# Altium schematic sheet schematic_Func_Gen.SchDoc
size B; SheetNumber: 1; SheetTotal: 1
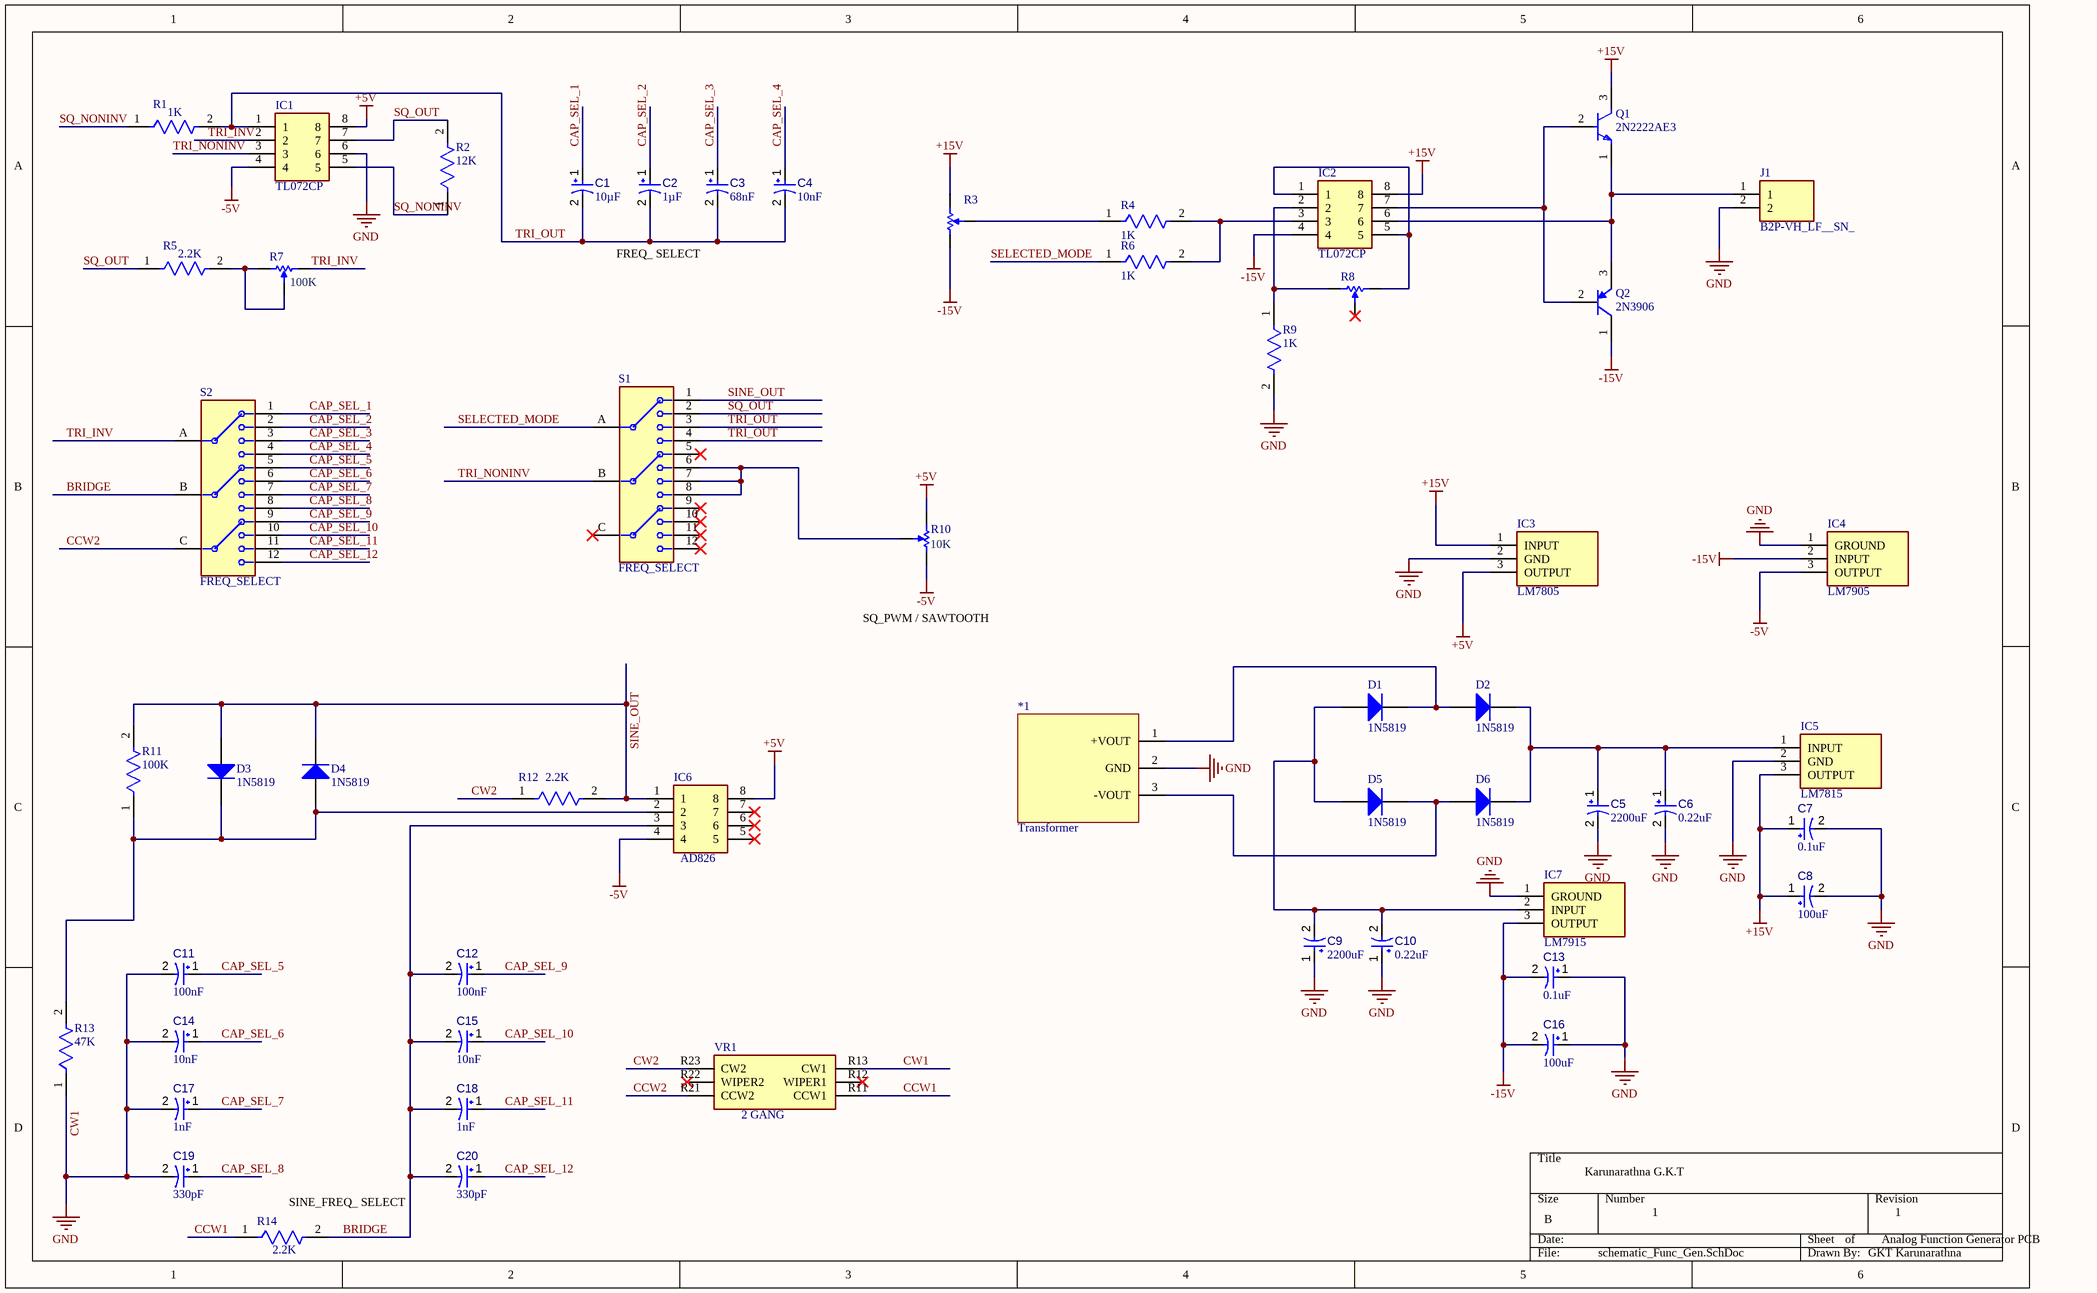
[diagram p0: schematic_Func_Gen.SchDoc]

## Parts
*1  Transformer  [transformer]
C1  value 10µF  [CAPPR65-500-1250X1000X1350]  (hidden comment: ECA-1HM221)
C2  value 1µF  [CAPPR65-500-1250X1000X1350]  (hidden comment: ECA-1HM221)
C3  value 68nF  [CAPPR65-500-1250X1000X1350]  (hidden comment: ECA-1HM221)
C4  value 10nF  [CAPPR65-500-1250X1000X1350]  (hidden comment: ECA-1HM221)
C5  value 2200uF  [CAPPR65-500-1250X1000X1350]  (hidden comment: ECA-1HM221)
C6  value 0.22uF  [CAPPR65-500-1250X1000X1350]  (hidden comment: ECA-1HM221)
C7  value 0.1uF  [CAPPR65-500-1250X1000X1350]  (hidden comment: ECA-1HM221)
C8  value 100uF  [CAPPR65-500-1250X1000X1350]  (hidden comment: ECA-1HM221)
C9  value 2200uF  [CAPPR65-500-1250X1000X1350]  (hidden comment: ECA-1HM221)
C10  value 0.22uF  [CAPPR65-500-1250X1000X1350]  (hidden comment: ECA-1HM221)
C11  value 100nF  [CAPPR65-500-1250X1000X1350]  (hidden comment: ECA-1HM221)
C12  value 100nF  [CAPPR65-500-1250X1000X1350]  (hidden comment: ECA-1HM221)
C13  value 0.1uF  [CAPPR65-500-1250X1000X1350]  (hidden comment: ECA-1HM221)
C14  value 10nF  [CAPPR65-500-1250X1000X1350]  (hidden comment: ECA-1HM221)
C15  value 10nF  [CAPPR65-500-1250X1000X1350]  (hidden comment: ECA-1HM221)
C16  value 100uF  [CAPPR65-500-1250X1000X1350]  (hidden comment: ECA-1HM221)
C17  value 1nF  [CAPPR65-500-1250X1000X1350]  (hidden comment: ECA-1HM221)
C18  value 1nF  [CAPPR65-500-1250X1000X1350]  (hidden comment: ECA-1HM221)
C19  value 330pF  [CAPPR65-500-1250X1000X1350]  (hidden comment: ECA-1HM221)
C20  value 330pF  [CAPPR65-500-1250X1000X1350]  (hidden comment: ECA-1HM221)
D1  1N5819  [ONSC-AXIAL_LEAD-2-59-10_P]
D2  1N5819  [ONSC-AXIAL_LEAD-2-59-10_P]
D3  1N5819  [ONSC-AXIAL_LEAD-2-59-10_P]
D4  1N5819  [ONSC-AXIAL_LEAD-2-59-10_P]
D5  1N5819  [ONSC-AXIAL_LEAD-2-59-10_P]
D6  1N5819  [ONSC-AXIAL_LEAD-2-59-10_P]
IC1  TL072CP  [DIPS762W70P254L1016H510Q8N]
IC2  TL072CP  [DIPS762W70P254L1016H510Q8N]
IC3  LM7805  [TO254P470X990X1900-3P]
IC4  LM7905  [TO254P470X1028X1955-3P]
IC5  LM7815  [TO254P470X990X1900-3P]
IC6  AD826  [DIPS762W70P254L1016H510Q8N]
IC7  LM7915  [TO254P470X1028X1955-3P]
J1  B2P-VH_LF__SN_  [HDRV2W114P0X396_1X2_786X850X1090P]
Q1  2N2222AE3  [FP-TO-18-MFG]
Q2  2N3906  [ONSC-TO-92-3-29-11_AM_BL]
R1  1K  [FP-RLR07-MFG]
R2  12K  [FP-RLR07-MFG]
R3  TC33X-2-103E  [BOUR-TC33X-2_V]  (value not drawn)
R4  1K  [FP-RLR07-MFG]
R5  2.2K  [FP-RLR07-MFG]
R6  1K  [FP-RLR07-MFG]
R7  TC33X-2-103E  [BOUR-TC33X-2_V]  (value not drawn)
R8  TC33X-2-103E  [BOUR-TC33X-2_V]  (value not drawn)
R9  1K  [FP-RLR07-MFG]
R10  TC33X-2-103E  [BOUR-TC33X-2_V]  (value not drawn)
R11  100K  [FP-RLR07-MFG]
R12  2.2K  [FP-RLR07-MFG]
R13  47K  [FP-RLR07-MFG]
R14  2.2K  [FP-RLR07-MFG]
S1  FREQ_SELECT  [SW_A30403RNCQ]
S2  FREQ_SELECT  [SW_A30403RNCQ]
VR1  2 GANG  [PDB182K220K104B]

## Nets
+5V: IC1.8 IC3.3(OUTPUT) IC6.8 R10.1
+15V: C7.1 C8.1 IC2.8 IC3.1(INPUT) IC5.3(OUTPUT) Q1.3(C) R3.3
-5V: IC1.4 IC4.3(OUTPUT) IC6.4 R10.3
-15V: C13.2 C16.2 IC2.4 IC4.2(INPUT) IC7.3(OUTPUT) Q2.1(C) R3.1
CW1: *1.2(GND) C5.2 C6.2 C7.2 C8.2 C9.1 C10.1 C11.2 C13.1 C14.2 C16.1 C17.2 C19.2 IC1.6 IC3.2(GND) IC4.1(GROUND) IC5.2(GND) IC7.1(GROUND) J1.2 R9.2 R13.1 VR1.R13(CW1)  [also labelled GND]
BRIDGE: C12.2 C15.2 C18.2 C20.2 IC6.3 R14.2 S2.B
CAP_SEL_1: C1.1 S2.1
CAP_SEL_2: C2.1 S2.2
CAP_SEL_3: C3.1 S2.3
CAP_SEL_4: C4.1 S2.4
CAP_SEL_5: C11.1 S2.5
CAP_SEL_6: C14.1 S2.6
CAP_SEL_7: C17.1 S2.7
CAP_SEL_8: C19.1 S2.8
CAP_SEL_9: C12.1 S2.9
CAP_SEL_10: C15.1 S2.10
CAP_SEL_11: C18.1 S2.11
CAP_SEL_12: C20.1 S2.12
CCW1: R14.1 VR1.R11(CCW1)
CCW2: S2.C VR1.R21(CCW2)
CW2: R12.1 VR1.R23(CW2)
SELECTED_MODE: R6.1 S1.A
SINE_OUT: D3.1(A) D4.2(K) IC6.1 R11.2 R12.2 S1.1
SQ_NONINV: IC1.5 R1.1 R2.1
SQ_OUT: IC1.7 R2.2 R5.1 S1.2
TRI_INV: IC1.2 R7.3 S2.A
TRI_NONINV: IC1.3 S1.B
TRI_OUT: C1.2 C2.2 C3.2 C4.2 IC1.1 R1.2 S1.3 S1.4
Net*1_1: *1.1(+VOUT) D1.2(K) D2.1(A)
Net*1_3: *1.3(-VOUT) D5.2(K) D6.1(A)
NetC5_1: C5.1 C6.1 D2.2(K) D6.2(K) IC5.1(INPUT)
NetC9_2: C9.2 C10.2 D1.1(A) D5.1(A) IC7.2(INPUT)
NetD3_2: D3.2(K) D4.1(A) IC6.2 R11.1 R13.2
NetIC2_1: IC2.1 IC2.5 R8.3
NetIC2_2: IC2.2 R8.1 R9.1
NetIC2_3: IC2.3 R4.2 R6.2
NetIC2_6: IC2.6 J1.1 Q1.1(E) Q2.3(E)
NetIC2_7: IC2.7 Q1.2(B) Q2.2(B)
NetR3_2: R3.2 R4.1
NetR5_2: R5.2 R7.1 R7.2
NetR10_2: R10.2 S1.6 S1.7 S1.8

Not connected (* = marked no-connect by the designer): IC6 5* 6* 7*; R8 2*; S1 5* 9* 10* 11* 12* C*; VR1 R12(WIPER1)* R22(WIPER2)*

## Notes on the sheet
- (near R7) 100K
- FREQ_ SELECT
- (near R10) 10K
- SQ_PWM / SAWTOOTH
- Karunarathna G.K.T
- (near R14) SINE_FREQ_ SELECT
- 1
- Analog Function Generator PCB
- GKT Karunarathna

## Library data of the parts
C1 C3-C20 = CMP-001-00028-7: Aluminum Electrolytic Capacitor, 220 uF, +/- 20%, 50 V, -40 to 85 degC, 2-Pin THD, RoHS, Bulk; Manufacturer: Panasonic; Ripple Current (AC): 400mA; Voltage Rating: 50V; Case/Package: Radial; Packaging: Bulk; Package Quantity: 200; Min Operating Temperature: -40°C; Datasheet Version: Mar-16; Package Reference: CAPPR65-500-1250X1000X1350; Mounting Technology: TH; Ripple Current: 400mA; Pins: 2; Package Description: 2-Pin Radial Lead, Dia 10 mm, Body Length 12.5 mm; RoHS Compliant: True; Max Operating Temperature: 85°C; Lead Pitch: 5mm; Tolerance: 20%; Manufacturer URL: http://www.panasonic.com/; Diameter: 10mm; Capacitor Type: Electrolytic; Datasheet URL: http://industrial.panasonic.com/cdbs/www-data/pdf/RDF0000/DMF0000COL68.pdf
C2 = CMP-001-00028-7: Aluminum Electrolytic Capacitor, 10 uF, +/- 20%, 50 V, -40 to 85 degC, 2-Pin THD, RoHS, Bulk; Manufacturer: Panasonic; Ripple Current (AC): 400mA; Voltage Rating: 50V; Case/Package: Radial; Packaging: Bulk; Package Quantity: 200; Min Operating Temperature: -40°C; Datasheet Version: Mar-16; Package Reference: CAPPR65-500-1250X1000X1350; Mounting Technology: TH; Ripple Current: 400mA; Pins: 2; Package Description: 2-Pin Radial Lead, Dia 10 mm, Body Length 12.5 mm; RoHS Compliant: True; Max Operating Temperature: 85°C; Lead Pitch: 5mm; Tolerance: 20%; Manufacturer URL: http://www.panasonic.com/; Diameter: 10mm; Capacitor Type: Electrolytic; Datasheet URL: http://industrial.panasonic.com/cdbs/www-data/pdf/RDF0000/DMF0000COL68.pdf
D1-D6 = CMP-004-00009-2: Low Drop Power Schottky Rectifier, 40 V, 1 A, 2-Pin DO-41, RoHS; Manufacturer: ON Semiconductor; Max Surge Current: 25A; Forward Current: 1A; Package Version: Rev. U, 02/2005; Peak Reverse Current: 1mA; Max Operating Temperature: 125°C; Case/Package: DO; Package URL: http://www.onsemi.cn/pub_link/Collateral/59-10.PDF; Packaging: Bulk; Manufacturer URL: http://www.onsemi.com/; Min Operating Temperature: -65°C; Package Description: 2-Pin, Axial Lead, Diameter 2.35 mm; Mounting Technology: TH; Datasheet URL: http://www.onsemi.cn/pub_link/Collateral/1N5817-D.PDF; Datasheet Version: Rev. 10, 07/2006; Package Reference: AXIAL_LEAD-2-59-10; Pins: 2; RoHS Compliant: True
IC1 IC2 IC6 = 1-2199298-2: Integrated Circuit; Manufacturer_Name: TE Connectivity; Datasheet Link: https://componentsearchengine.com/Datasheets/2/1-2199298-2.pdf; Height: 5.1mm; Manufacturer_Part_Number: 1-2199298-2; Mouser Part Number: 571-1-2199298-2; Mouser Price/Stock: https://www.mouser.co.uk/ProductDetail/TE-Connectivity/1-2199298-2?qs=fK8dlpkaUMtEKa4wabwOXQ%3D%3D; Arrow Part Number: 1-2199298-2; Arrow Price/Stock: https://www.arrow.com/en/products/1-2199298-2/te-connectivity?utm_currency=USD&region=europe
IC3 IC5 = LM7805: Integrated Circuit; Manufacturer_Name: SEMELAB; Datasheet Link: https://pdf1.alldatasheet.com/datasheet-pdf/view/82833/FAIRCHILD/LM7805.html; Height: 4.7mm; Manufacturer_Part_Number: LM7805
IC4 IC7 = LM7905CT: Integrated Circuit; Manufacturer_Name: Texas Instruments; Datasheet Link: https://www.ti.com/lit/gpn/lm79; Height: 4.7mm; Manufacturer_Part_Number: LM7905CT; Mouser Part Number: 926-LM7905CT; Mouser Price/Stock: https://www.mouser.co.uk/ProductDetail/Texas-Instruments/LM7905CT?qs=QbsRYf82W3Eiau4ggA8dIA%3D%3D; Arrow Part Number: LM7905CT; Arrow Price/Stock: https://www.arrow.com/en/products/lm7905ct/texas-instruments?region=nac
J1 = B2P-VH_LF__SN_: Connector; Manufacturer_Name: JST (JAPAN SOLDERLESS TERMINALS); Manufacturer_Part_Number: B2P-VH(LF)(SN); Datasheet Link: https://datasheet.lcsc.com/szlcsc/JST-Sales-America-VHseries-socket-1-2P-pitch3-96mm-Straight-line_C160315.pdf; Height: 10.9mm; Mouser Part Number: N/A; Mouser Price/Stock: https://www.mouser.co.uk/ProductDetail/JST-Commercial/B2P-VHLFSN?qs=QpmGXVUTftHAqi50yPzpkg%3D%3D; Arrow Part Number: B2P-VH(LF)(SN); Arrow Price/Stock: https://www.arrow.com/en/products/b2p-vh-lf-sn/jst-manufacturing?region=europe
Q1 = CMP-00252-99177200-1: 2N2222AE3 Bipolar (BJT) Transistor NPN 50V 800mA 500mW Through Hole TO-18; Collector Emitter Saturation Voltage: 1V; Collector Base Voltage (VCBO): 75V; Number of Elements: 1; hFE Min: 100; Max Junction Temperature (Tj): 200°C; Emitter Base Voltage (VEBO): 6V; Power Dissipation: 500mW; Case/Package: TO-18; RoHS: Compliant; Max Collector Current: 800mA; Height: 5.33mm; Collector Emitter Breakdown Voltage: 50V; Max Power Dissipation: 500mW; Collector Emitter Voltage (VCEO): 50V; Number of Pins: 3; Radiation Hardening: No; NexarPartId: 99177200; Mount: Through Hole; Packaging: Bulk; Min Operating Temperature: -65°C; Max Operating Temperature: 200°C
Q2 = CMP-1048-01514-1: Amplifier Transistor, PNP Silicon, 3-Pin TO-92, Pb-Free, Ammo Box; PartNumber: BC557AZL1G; Manufacturer: On Semiconductor; IC Continuous (A): -0.1; ComponentLink1Description: Manufacturer URL; ComponentLink2URL: http://www.onsemi.com/pub_link/Collateral/BC556B-D.PDF; PackageVersion: Rev. AM; Mounting Technology: Through Hole; Polarity: PNP; RoHS: TRUE; ComponentLink3URL: http://www.onsemi.com/pub_link/Collateral/MAC97-D.PDF; ComponentLink3Description: Package Specification; ComponentLink1URL: http://www.onsemi.com/; PackageDescription: 3-Pin Transistor Outline, Body 4.825 x 3.685 mm, Pitch 1.27 mm; Packing: Ammo Box; PackageReference: TO-92-3-29-11_AM_BL; ComponentLink2Description: Datasheet; DatasheetVersion: Rev. 3
R1 R2 R4-R6 R9 R11-R14 = CMP-00030-42769933-1: RLR07C15R0FSB14 Res Metal Film 15 Ohm 1% 1/4W ±100ppm/°C 0.001% Conformal AXL Thru-Hole Bulk; Power Rating: 250mW; Resistance: 15Ω; Failure Rate: 0.001%; Contact Plating: Lead, Tin; Case/Package: Conformal; Width: 2.29mm; Min Operating Temperature: -65°C; Number of Terminations: 2; Features: Military, Moisture Resistant, Weldable; Military Standard: MIL-PRF-39017; Length: 7.62mm; NexarPartId: 42769933; Temperature Coefficient: 100ppm/°C; Mount: Through Hole; Tolerance: 1%; Diameter: 2.29mm; Max Operating Temperature: 150°C; Packaging: Bulk; Schedule B: 8533210090; Max Power Dissipation: 250mW; Lead Free: Contains Lead; Termination: Axial; RoHS: Compliant; Composition: Metal Film
R3 R7 R8 R10 = CMP-009-00060-3: Trimming Potentiometer, 10000 Ohm, -40 to 100 degC, 3-Pin SMD, RoHS, Tape and Reel; Manufacturer: Bourns; Tolerance: 25%; Resistance: 10k; Power: 100mW; Datasheet URL: http://www.bourns.com/docs/Product-Datasheets/TC33.pdf; Min Operating Temperature: -40°C; Packaging: TapeandReel; RoHS Compliant: True; Package Reference: TC33X-2; Max Operating Temperature: 120°C; Datasheet Version: Aug-16; Composition: Potentiometer; Package Quantity: 2500; Manufacturer URL: http://www.bourns.com/; Mounting Technology: SM; Package Description: 3-Pin Surface Mount Device, Body 3.8 x 3.6 mm; Case/Package: TC33X-2
S1 S2 = A30403RNCQ: Rotary Switch 4 Position 3P4T 2.5A (AC), 350mA (DC) 125 VAC Panel Mount, Through Hole; MF: C&K; SnapEDA_Link: https://www.snapeda.com/parts/A30403RNCQ/C%2526K/view-part/?ref=snap; Package: None; Value: *; MP: A30403RNCQ; Check_prices: https://www.snapeda.com/parts/A30403RNCQ/C%2526K/view-part/?ref=eda
VR1 = PDB182-K220K-104B: Variable Resistor; Manufacturer_Name: Bourns; Datasheet Link: https://www.bourns.com/docs/Product-Datasheets/PDB18.pdf; Height: 21mm; Manufacturer_Part_Number: PDB182-K220K-104B; Mouser Part Number: 652-PDB182-K220K104B; Mouser Price/Stock: https://www.mouser.co.uk/ProductDetail/Bourns/PDB182-K220K-104B?qs=Ivs1Be2ZGq5w5ayg3Iig0w%3D%3D; Arrow Part Number: PDB182-K220K-104B; Arrow Price/Stock: https://www.arrow.com/en/products/pdb182-k220k-104b/bourns?utm_currency=USD&region=nac